# Altium project STM32F417 Demo Board.PrjPcb (part 1 of 4)
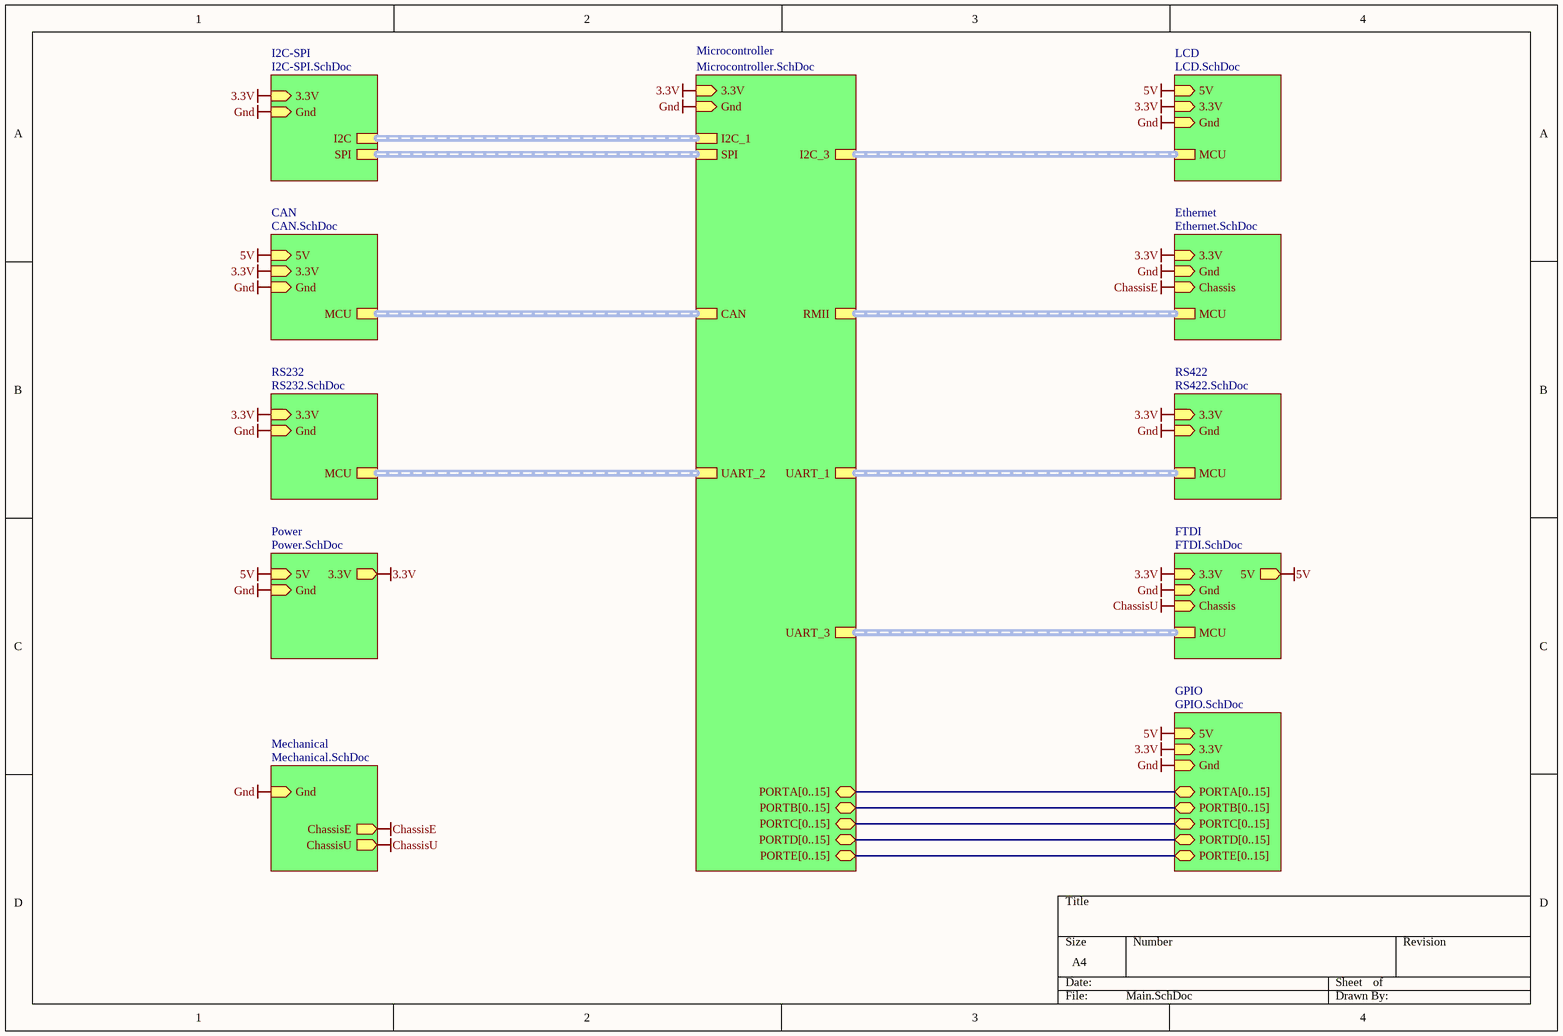
[diagram p0: Main.SchDoc]
15 sheets, 357 parts. Net scope: strictly hierarchical (ports join the sheet entries above them; power ports are local).
Board file: PCB.PcbDoc
Sheets:
  Main.SchDoc
    Microcontroller = Microcontroller.SchDoc
    LCD = LCD.SchDoc
    FTDI = FTDI.SchDoc
    Power = Power.SchDoc
    GPIO = GPIO.SchDoc
      Bt1 = Button.SchDoc
      Bt2 = Button.SchDoc
      Bt3 = Button.SchDoc
      Sw1 = Switch.SchDoc
      Sw2 = Switch.SchDoc
      Sw3 = Switch.SchDoc
      LdR = Led Driver.SchDoc
      LdO = Led Driver.SchDoc
      LdY = Led Driver.SchDoc
      LdG = Led Driver.SchDoc
    Ethernet = Ethernet.SchDoc
    RS422 = RS422.SchDoc
    RS232 = RS232.SchDoc
    CAN = CAN.SchDoc
    Mechanical = Mechanical.SchDoc
    I2C-SPI = I2C-SPI.SchDoc

## Sheet Main.SchDoc
size A4; SheetNumber: 1; SheetTotal: 15

### Sub-sheets
CAN = CAN.SchDoc: 3.3V (in), Gnd (in), MCU (harness CAN), 5V (in)
Ethernet = Ethernet.SchDoc: 3.3V (in), Gnd (in), MCU (harness RMII), Chassis (in)
FTDI = FTDI.SchDoc: 3.3V (in), Gnd (in), MCU (harness UART), 5V (out), Chassis (in)
GPIO = GPIO.SchDoc: 3.3V (in), Gnd (in), PORTA[0..15] (bidir), PORTB[0..15] (bidir), PORTC[0..15] (bidir), PORTD[0..15] (bidir), PORTE[0..15] (bidir), 5V (in)
I2C-SPI = I2C-SPI.SchDoc: 3.3V (in), Gnd (in), I2C (harness I2C), SPI (harness SPI)
LCD = LCD.SchDoc: 3.3V (in), Gnd (in), MCU (harness I2C), 5V (in)
Mechanical = Mechanical.SchDoc: ChassisU (out), Gnd (in), ChassisE (out)
Microcontroller = Microcontroller.SchDoc: I2C_3 (harness I2C), I2C_1 (harness I2C), UART_3 (harness UART), UART_1 (harness UART), UART_2 (harness UART), RMII (harness RMII), CAN (harness CAN), PORTA[0..15] (bidir), PORTB[0..15] (bidir), PORTC[0..15] (bidir), PORTD[0..15] (bidir), PORTE[0..15] (bidir), 3.3V (in), Gnd (in), SPI (harness SPI)
Power = Power.SchDoc: 5V (in), Gnd (in), 3.3V (out)
RS232 = RS232.SchDoc: 3.3V (in), Gnd (in), MCU (harness UART)
RS422 = RS422.SchDoc: 3.3V (in), Gnd (in), MCU (harness UART)

### Nets
3.3V: sheet Microcontroller/3.3V, sheet LCD/3.3V, sheet FTDI/3.3V, sheet Power/3.3V, sheet GPIO/3.3V, sheet Ethernet/3.3V, sheet RS422/3.3V, sheet RS232/3.3V, sheet CAN/3.3V, sheet I2C-SPI/3.3V
5V: sheet LCD/5V, sheet FTDI/5V, sheet Power/5V, sheet GPIO/5V, sheet CAN/5V
ChassisE: sheet Ethernet/Chassis, sheet Mechanical/ChassisE
ChassisU: sheet FTDI/Chassis, sheet Mechanical/ChassisU
Gnd: sheet Microcontroller/Gnd, sheet LCD/Gnd, sheet FTDI/Gnd, sheet Power/Gnd, sheet GPIO/Gnd, sheet Ethernet/Gnd, sheet RS422/Gnd, sheet RS232/Gnd, sheet CAN/Gnd, sheet Mechanical/Gnd, sheet I2C-SPI/Gnd

### Buses and harness runs
bus sheet GPIO/PORTA[0..15] = sheet Microcontroller/PORTA[0..15]
bus sheet GPIO/PORTB[0..15] = sheet Microcontroller/PORTB[0..15]
bus sheet GPIO/PORTC[0..15] = sheet Microcontroller/PORTC[0..15]
bus sheet GPIO/PORTD[0..15] = sheet Microcontroller/PORTD[0..15]
bus sheet GPIO/PORTE[0..15] = sheet Microcontroller/PORTE[0..15]
harness sheet CAN/MCU = sheet Microcontroller/CAN
harness sheet Ethernet/MCU = sheet Microcontroller/RMII
harness sheet FTDI/MCU = sheet Microcontroller/UART_3
harness sheet I2C-SPI/I2C = sheet Microcontroller/I2C_1
harness sheet I2C-SPI/SPI = sheet Microcontroller/SPI
harness sheet LCD/MCU = sheet Microcontroller/I2C_3
harness sheet Microcontroller/UART_1 = sheet RS422/MCU
harness sheet Microcontroller/UART_2 = sheet RS232/MCU

## Sheet Microcontroller.SchDoc
size 400 x 350 mm; SheetNumber: 2; SheetTotal: 15
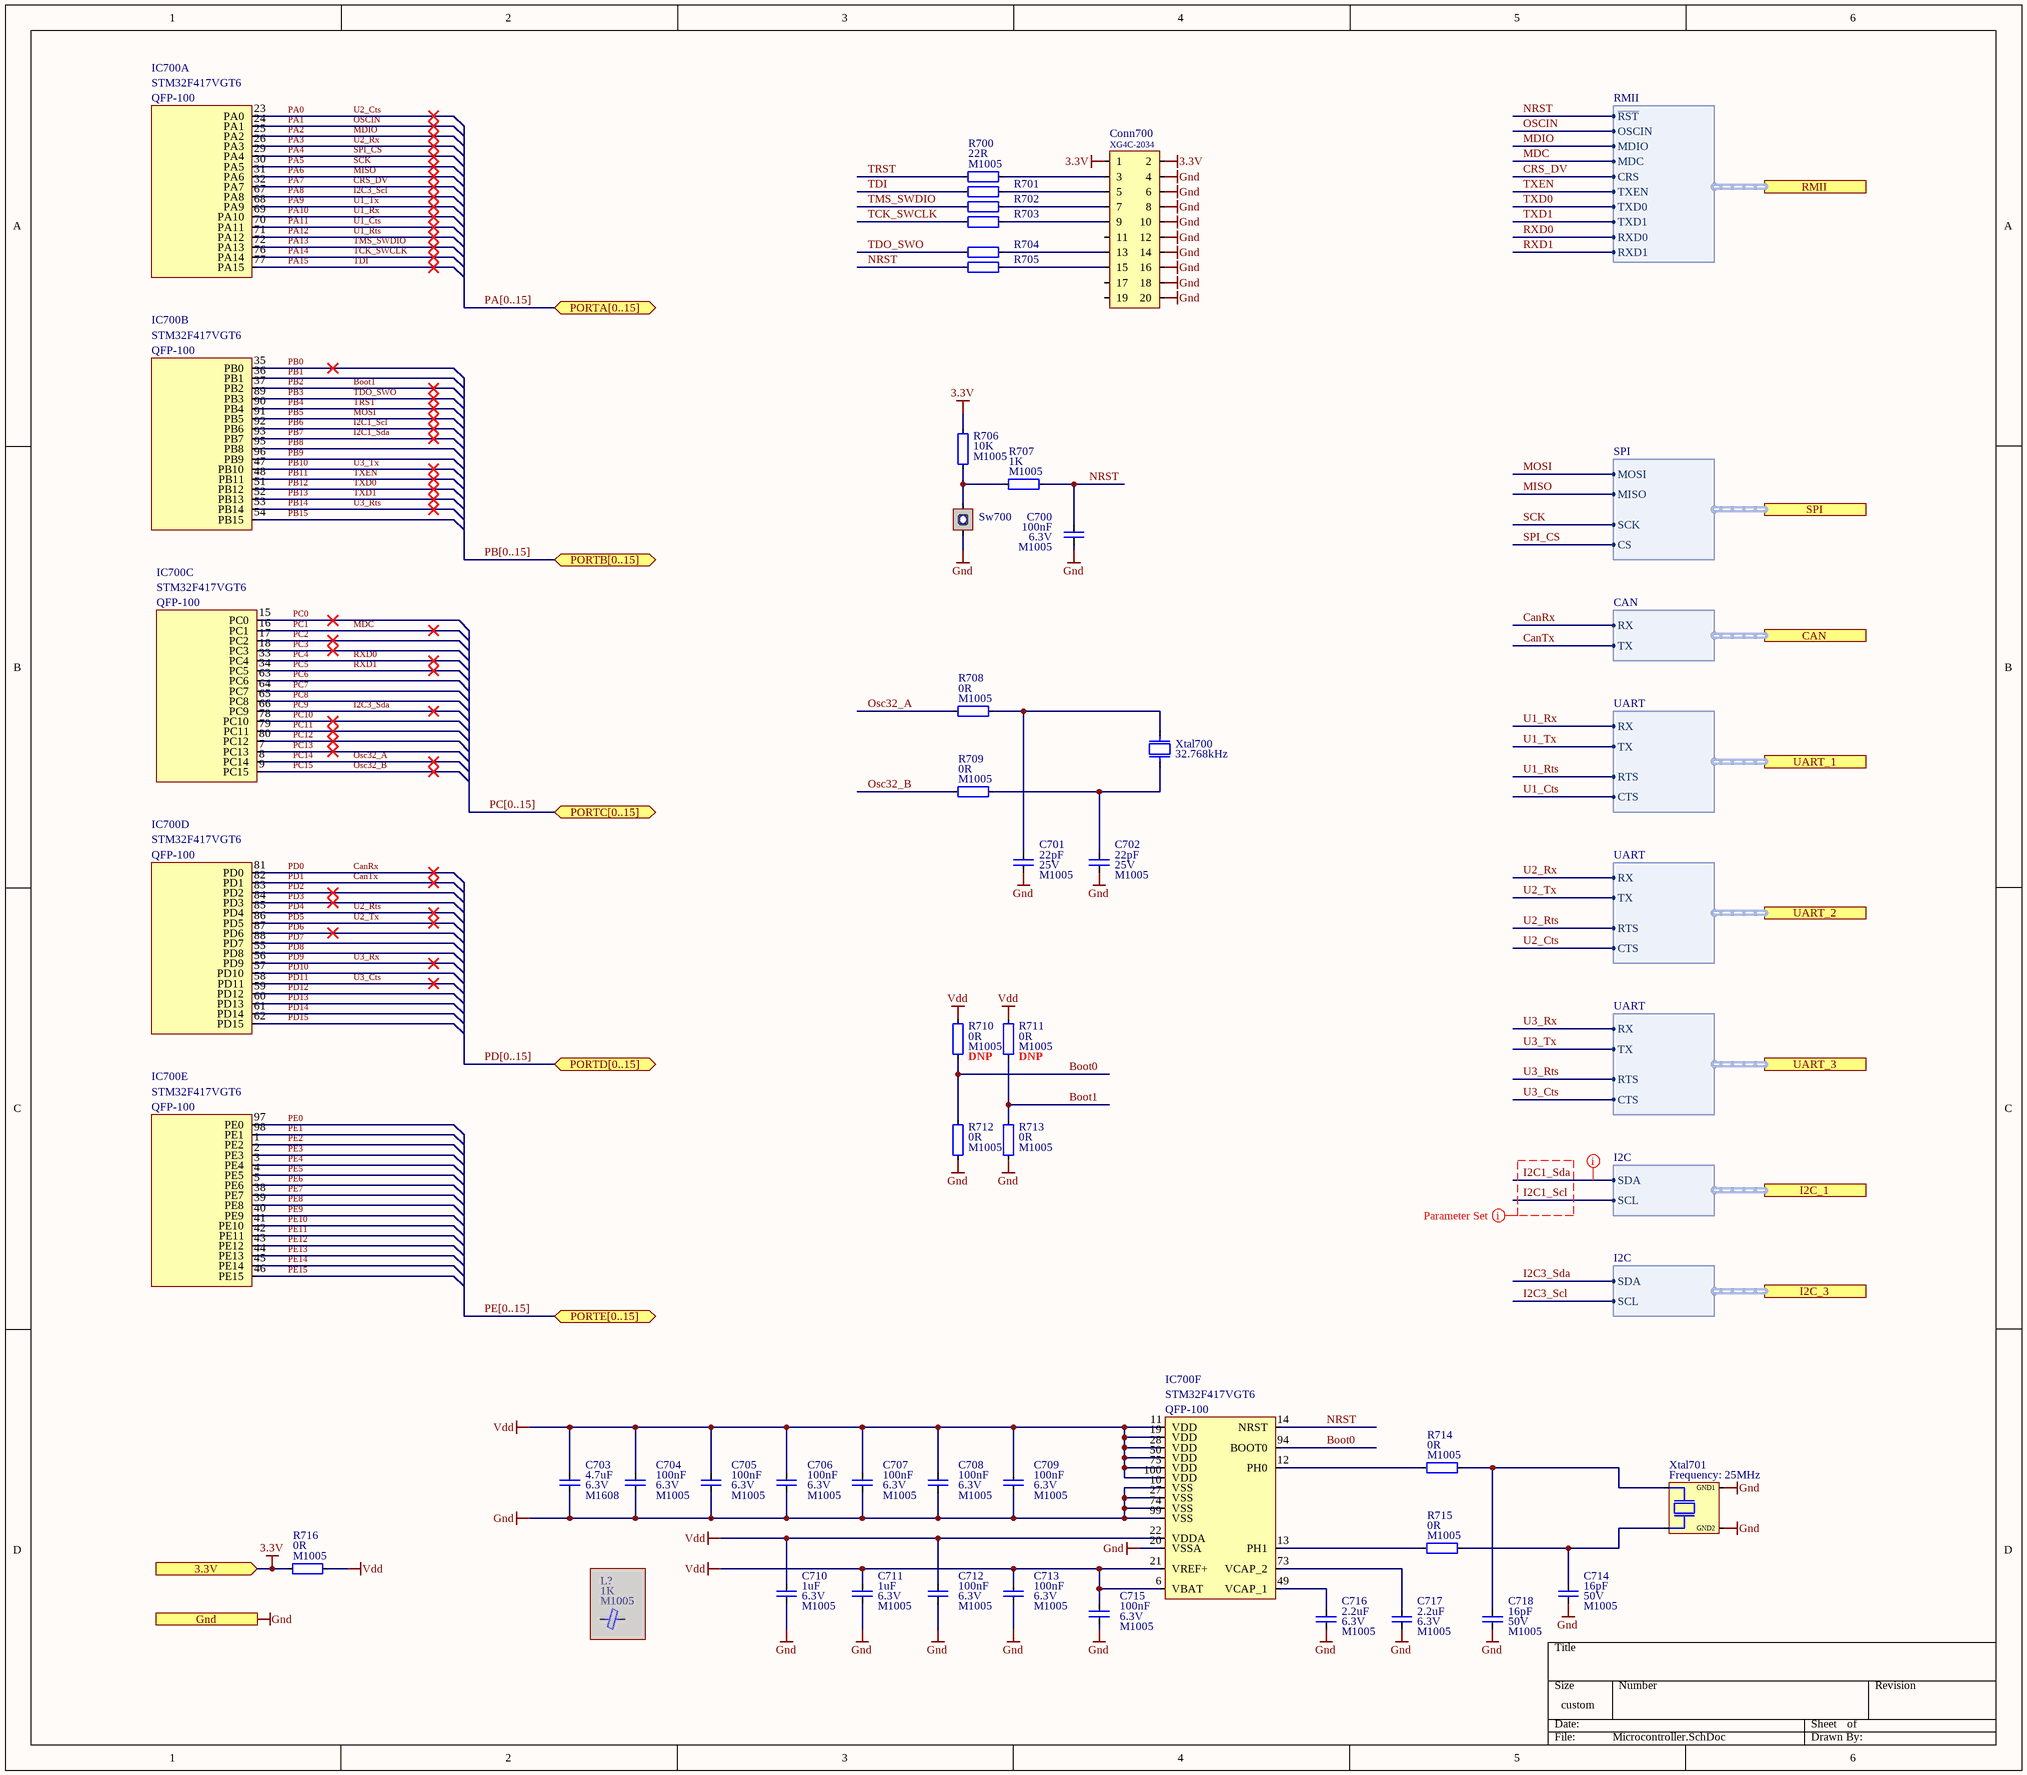
[diagram p1: Microcontroller.SchDoc]

### Parts
C700  value 100nF  Voltage: 6.3V  Package: M1005  [Capacitor_Ceramic_M1005_I0402]  (hidden comment: Capacitor_Ceramic)
C701  value 22pF  Voltage: 25V  Package: M1005  [Capacitor_Ceramic_M1005_I0402]  (hidden comment: Capacitor_Ceramic)
C702  value 22pF  Voltage: 25V  Package: M1005  [Capacitor_Ceramic_M1005_I0402]  (hidden comment: Capacitor_Ceramic)
C703  value 4.7uF  Voltage: 6.3V  Package: M1608  [Capacitor_Ceramic_M1608_I0603]  (hidden comment: Capacitor_Ceramic)
C704  value 100nF  Voltage: 6.3V  Package: M1005  [Capacitor_Ceramic_M1005_I0402]  (hidden comment: Capacitor_Ceramic)
C705  value 100nF  Voltage: 6.3V  Package: M1005  [Capacitor_Ceramic_M1005_I0402]  (hidden comment: Capacitor_Ceramic)
C706  value 100nF  Voltage: 6.3V  Package: M1005  [Capacitor_Ceramic_M1005_I0402]  (hidden comment: Capacitor_Ceramic)
C707  value 100nF  Voltage: 6.3V  Package: M1005  [Capacitor_Ceramic_M1005_I0402]  (hidden comment: Capacitor_Ceramic)
C708  value 100nF  Voltage: 6.3V  Package: M1005  [Capacitor_Ceramic_M1005_I0402]  (hidden comment: Capacitor_Ceramic)
C709  value 100nF  Voltage: 6.3V  Package: M1005  [Capacitor_Ceramic_M1005_I0402]  (hidden comment: Capacitor_Ceramic)
C710  value 1uF  Voltage: 6.3V  Package: M1005  [Capacitor_Ceramic_M1005_I0402]  (hidden comment: Capacitor_Ceramic)
C711  value 1uF  Voltage: 6.3V  Package: M1005  [Capacitor_Ceramic_M1005_I0402]  (hidden comment: Capacitor_Ceramic)
C712  value 100nF  Voltage: 6.3V  Package: M1005  [Capacitor_Ceramic_M1005_I0402]  (hidden comment: Capacitor_Ceramic)
C713  value 100nF  Voltage: 6.3V  Package: M1005  [Capacitor_Ceramic_M1005_I0402]  (hidden comment: Capacitor_Ceramic)
C714  value 16pF  Voltage: 50V  Package: M1005  [Capacitor_Ceramic_M1005_I0402]  (hidden comment: Capacitor_Ceramic)
C715  value 100nF  Voltage: 6.3V  Package: M1005  [Capacitor_Ceramic_M1005_I0402]  (hidden comment: Capacitor_Ceramic)
C716  value 2.2uF  Voltage: 6.3V  Package: M1005  [Capacitor_Ceramic_M1005_I0402]  (hidden comment: Capacitor_Ceramic)
C717  value 2.2uF  Voltage: 6.3V  Package: M1005  [Capacitor_Ceramic_M1005_I0402]  (hidden comment: Capacitor_Ceramic)
C718  value 16pF  Voltage: 50V  Package: M1005  [Capacitor_Ceramic_M1005_I0402]  (hidden comment: Capacitor_Ceramic)
Conn700  Manufacturer Part Number: XG4C-2034  [Connector - Omron, XG4C-2034]  (hidden comment: Connector - 20P)
IC700  Manufacturer Part Number: STM32F417VGT6  Package: QFP-100  [QFP-100, 14mm x 14mm, 0.5mm]  (hidden comment: STM, STM32F417VxTx)  (parts A,B,C,D,E,F of 6)
L?  value 1K  Package: M1005  [Ferrite_Bead_Smd_M1005_I0402]  (hidden comment: Ferrite Bead)  (masked out: inside a compile mask, not in the netlist)
R700  value 22R  Package: M1005  [Resistor_Smd_M1005_I0402]  (hidden comment: Resistor)
R701  Resistor  [Resistor_Smd_M1005_I0402]  (value not drawn)
R702  Resistor  [Resistor_Smd_M1005_I0402]  (value not drawn)
R703  Resistor  [Resistor_Smd_M1005_I0402]  (value not drawn)
R704  Resistor  [Resistor_Smd_M1005_I0402]  (value not drawn)
R705  Resistor  [Resistor_Smd_M1005_I0402]  (value not drawn)
R706  value 10K  Package: M1005  [Resistor_Smd_M1005_I0402]  (hidden comment: Resistor)
R707  value 1K  Package: M1005  [Resistor_Smd_M1005_I0402]  (hidden comment: Resistor)
R708  value 0R  Package: M1005  [Resistor_Smd_M1005_I0402]  (hidden comment: Resistor)
R709  value 0R  Package: M1005  [Resistor_Smd_M1005_I0402]  (hidden comment: Resistor)
R710  value 0R  Package: M1005  [Resistor_Smd_M1005_I0402]  (hidden comment: Resistor)
R711  value 0R  Package: M1005  [Resistor_Smd_M1005_I0402]  (hidden comment: Resistor)
R712  value 0R  Package: M1005  [Resistor_Smd_M1005_I0402]  (hidden comment: Resistor)
R713  value 0R  Package: M1005  [Resistor_Smd_M1005_I0402]  (hidden comment: Resistor)
R714  value 0R  Package: M1005  [Resistor_Smd_M1005_I0402]  (hidden comment: Resistor)
R715  value 0R  Package: M1005  [Resistor_Smd_M1005_I0402]  (hidden comment: Resistor)
R716  value 0R  Package: M1005  [Resistor_Smd_M1005_I0402]  (hidden comment: Resistor)
Sw700  Tactile, SPST  [Tactile, SPST - Panasonic, EVQQ2]  (value not drawn)
Xtal700  Frequency: 32.768kHz  [NDK, NX3215SA]  (hidden comment: Crystal)
Xtal701  Frequency: 25MHz  [Kyocera, CX3225SB]  (hidden comment: Crystal, Two Gnd Pins)

### Ports
3.3V (in), CAN (harness CAN), Gnd (in), I2C_1 (harness I2C), I2C_3 (harness I2C), PORTA[0..15] (bidir), PORTB[0..15] (bidir), PORTC[0..15] (bidir), PORTD[0..15] (bidir), PORTE[0..15] (bidir), RMII (harness RMII), SPI (harness SPI), UART_1 (harness UART), UART_2 (harness UART), UART_3 (harness UART)

### Harnesses
I2C: SDA, SCL
UART: RX, TX, RTS, CTS
CAN: RX, TX
SPI: MOSI, MISO, SCK, CS
RMII: ~{RST}, OSCIN, MDIO, CRS, MDC, TXEN, TXD0, TXD1, RXD0, RXD1

### Nets
3.3V: Conn700.1 Conn700.2 R706.1 R716.1 ; port 3.3V
Gnd: C700.2 C701.2 C702.2 C703.2 C704.2 C705.2 C706.2 C707.2 C708.2 C709.2 C710.2 C711.2 C712.2 C713.2 C714.2 C715.2 C716.2 C717.2 C718.2 Conn700.4 Conn700.6 Conn700.8 Conn700.10 Conn700.12 Conn700.14 Conn700.16 Conn700.18 Conn700.20 IC700.10(VSS) IC700.20(VSSA) IC700.27(VSS) IC700.74(VSS) IC700.99(VSS) R712.1 R713.1 Sw700.B Xtal701.GND1 Xtal701.GND2 ; port Gnd
Vdd: C703.1 C704.1 C705.1 C706.1 C707.1 C708.1 C709.1 C710.1 C711.1 C712.1 C713.1 C715.1 IC700.6(VBAT) IC700.11(VDD) IC700.19(VDD) IC700.21(VREF+) IC700.22(VDDA) IC700.28(VDD) IC700.50(VDD) IC700.75(VDD) IC700.100(VDD) R710.2 R711.2 R716.2
Boot0: IC700.94(BOOT0) R710.1 R712.2
Boot1: IC700.37(PB2) R711.1 R713.2  [also labelled PB2]
CanRx: IC700.81(PD0) ; port CAN.RX  [also labelled PD0]
CanTx: IC700.82(PD1) ; port CAN.TX  [also labelled PD1]
CRS_DV: IC700.32(PA7) ; port RMII.CRS  [also labelled PA7]
I2C1_Scl: IC700.92(PB6) ; port I2C_1.SCL  [also labelled PB6]
I2C1_Sda: IC700.93(PB7) ; port I2C_1.SDA  [also labelled PB7]
I2C3_Scl: IC700.67(PA8) ; port I2C_3.SCL  [also labelled PA8]
I2C3_Sda: IC700.66(PC9) ; port I2C_3.SDA  [also labelled PC9]
MDC: IC700.16(PC1) ; port RMII.MDC  [also labelled PC1]
MDIO: IC700.25(PA2) ; port RMII.MDIO  [also labelled PA2]
MISO: IC700.31(PA6) ; port SPI.MISO  [also labelled PA6]
MOSI: IC700.91(PB5) ; port SPI.MOSI  [also labelled PB5]
NRST: C700.1 IC700.14(NRST) R705.1 R707.2 ; port RMII.~{RST}
Osc32_A: IC700.8(PC14) R708.1  [also labelled PC14]
Osc32_B: IC700.9(PC15) R709.1  [also labelled PC15]
OSCIN: IC700.24(PA1) ; port RMII.OSCIN  [also labelled PA1]
PA0: IC700.23(PA0) ; port UART_2.CTS  [also labelled U2_Cts]
PA3: IC700.26(PA3) ; port UART_2.RX  [also labelled U2_Rx]
PA4: IC700.29(PA4) ; port SPI.CS  [also labelled SPI_CS]
PA5: IC700.30(PA5) ; port SPI.SCK  [also labelled SCK]
PA9: IC700.68(PA9) ; port UART_1.TX  [also labelled U1_Tx]
PA10: IC700.69(PA10) ; port UART_1.RX  [also labelled U1_Rx]
PA11: IC700.70(PA11) ; port UART_1.CTS  [also labelled U1_Cts]
PA12: IC700.71(PA12) ; port UART_1.RTS  [also labelled U1_Rts]
PA13: IC700.72(PA13) R702.1  [also labelled TMS_SWDIO]
PA14: IC700.76(PA14) R703.1  [also labelled TCK_SWCLK]
PA15: IC700.77(PA15) R701.1  [also labelled TDI]
PB0: IC700.35(PB0)
PB1: IC700.36(PB1)
PB3: IC700.89(PB3) R704.1  [also labelled TDO_SWO]
PB4: IC700.90(PB4) R700.1  [also labelled TRST]
PB8: IC700.95(PB8)
PB9: IC700.96(PB9)
PB10: IC700.47(PB10) ; port UART_3.TX  [also labelled U3_Tx]
PB11: IC700.48(PB11) ; port RMII.TXEN  [also labelled TXEN]
PB12: IC700.51(PB12) ; port RMII.TXD0  [also labelled TXD0]
PB13: IC700.52(PB13) ; port RMII.TXD1  [also labelled TXD1]
PB14: IC700.53(PB14) ; port UART_3.RTS  [also labelled U3_Rts]
PB15: IC700.54(PB15)
PC0: IC700.15(PC0)
PC2: IC700.17(PC2)
PC3: IC700.18(PC3)
PC4: IC700.33(PC4) ; port RMII.RXD0  [also labelled RXD0]
PC5: IC700.34(PC5) ; port RMII.RXD1  [also labelled RXD1]
PC6: IC700.63(PC6)
PC7: IC700.64(PC7)
PC8: IC700.65(PC8)
PC10: IC700.78(PC10)
PC11: IC700.79(PC11)
PC12: IC700.80(PC12)
PC13: IC700.7(PC13)
PD2: IC700.83(PD2)
PD3: IC700.84(PD3)
PD4: IC700.85(PD4) ; port UART_2.RTS  [also labelled U2_Rts]
PD5: IC700.86(PD5) ; port UART_2.TX  [also labelled U2_Tx]
PD6: IC700.87(PD6)
PD7: IC700.88(PD7)
PD8: IC700.55(PD8)
PD9: IC700.56(PD9) ; port UART_3.RX  [also labelled U3_Rx]
PD10: IC700.57(PD10)
PD11: IC700.58(PD11) ; port UART_3.CTS  [also labelled U3_Cts]
PD12: IC700.59(PD12)
PD13: IC700.60(PD13)
PD14: IC700.61(PD14)
PD15: IC700.62(PD15)
PE0: IC700.97(PE0)
PE1: IC700.98(PE1)
PE2: IC700.1(PE2)
PE3: IC700.2(PE3)
PE4: IC700.3(PE4)
PE5: IC700.4(PE5)
PE6: IC700.5(PE6)
PE7: IC700.38(PE7)
PE8: IC700.39(PE8)
PE9: IC700.40(PE9)
PE10: IC700.41(PE10)
PE11: IC700.42(PE11)
PE12: IC700.43(PE12)
PE13: IC700.44(PE13)
PE14: IC700.45(PE14)
PE15: IC700.46(PE15)
NetC701_1: C701.1 R708.2 Xtal700.2
NetC702_1: C702.1 R709.2 Xtal700.1
NetC714_1: C714.1 R715.2 Xtal701.1
NetC716_1: C716.1 IC700.49(VCAP_1)
NetC717_1: C717.1 IC700.73(VCAP_2)
NetC718_1: C718.1 R714.2 Xtal701.2
NetConn700_3: Conn700.3 R700.2
NetConn700_5: Conn700.5 R701.2
NetConn700_7: Conn700.7 R702.2
NetConn700_9: Conn700.9 R703.2
NetConn700_13: Conn700.13 R704.2
NetConn700_15: Conn700.15 R705.2
NetIC700_12: IC700.12(PH0) R714.1
NetIC700_13: IC700.13(PH1) R715.1
NetR706_2: R706.2 R707.1 Sw700.A

Not connected (* = marked no-connect by the designer): Conn700 11 17 19

### Buses and harness runs
bus PA[0..15] = port PORTA[0..15]
bus PB[0..15] = port PORTB[0..15]
bus PC[0..15] = port PORTC[0..15]
bus PD[0..15] = port PORTD[0..15]
bus PE[0..15] = port PORTE[0..15]

### Layout directives
net class I2C_LM: I2C1_Scl, I2C1_Sda

### Notes on the sheet
- (near R710) DNP
- (near R711) DNP

### Library data of the parts
C700 C704-C709 C712 C713 C715 = Capacitor_Ceramic: Cap, Cer, 100nF, 6.3V, M1005; Manufacturer Part Number: 04026D104KAT4A; Manufacturer: Kyocera; Temperature Coefficient: X5R; Tolerance: 10%; ComponentLink1Description: Datasheet; ComponentLink1URL: E:\Altium\Datasheets\Capacitor\Kyocera - X5R.pdf; ComponentLink2Description: Supplier Link; ComponentLink2URL: https://www.digikey.com/en/products/detail/kyocera-avx/04026D104KAT4A/8107673; Supplier: Digikey; Supplier Part Number: 478-11504-1-ND; Operating Temperature, Min: +85℃; Operating Temperature, Max: -55℃; Quantity, Min: 1; Quantity, Max: 250000; Price, Min: 0.1; Supplier Currency: $; Price, Max: 0.00189; Supplier Link: https://www.digikey.com/en/products/detail/kyocera-avx/04026D104KAT4A/8107673; Component Type: Ceramic; Component Category: Capacitor
C701 C702 = Capacitor_Ceramic: Cap, Cer, 22pF, 25V, M1005; Manufacturer Part Number: 0402N220J250CT; Manufacturer: Walsin; Temperature Coefficient: C0G, NP0; Tolerance: 5%; ComponentLink1Description: Datasheet; ComponentLink1URL: E:\Altium\Datasheets\Capacitor\Walsin - Multilayer Ceramic Capacitors.pdf; ComponentLink2Description: Supplier Link; ComponentLink2URL: https://www.digikey.com/en/products/detail/walsin-technology-corporation/0402N220J250CT/9354779; Supplier: Digikey; Supplier Part Number: 1292-1282-1-ND; Operating Temperature, Min: +125℃; Operating Temperature, Max: -55℃; Quantity, Min: 1; Quantity, Max: 250000; Price, Min: 0.1; Supplier Currency: $; Price, Max: 0.00177; Supplier Link: https://www.digikey.com/en/products/detail/walsin-technology-corporation/0402N220J250CT/9354779; Component Type: Ceramic; Component Category: Capacitor
C703 = Capacitor_Ceramic: Cap, Cer, 4.7uF, 6.3V, M1608; Manufacturer Part Number: CL10A475KQ8NNNC; Manufacturer: Samsung; Temperature Coefficient: X5R; Tolerance: 10%; ComponentLink1Description: Datasheet; ComponentLink1URL: E:\Altium\Datasheets\Capacitor\Samsung - Multi Layer Ceramic Capacitors.pdf; ComponentLink2Description: Supplier Link; ComponentLink2URL: https://www.digikey.com/en/products/detail/samsung-electro-mechanics/CL10A475KQ8NNNC/3886703; Supplier: Digikey; Supplier Part Number: 1276-1045-1-ND; Operating Temperature, Min: +85℃; Operating Temperature, Max: -55℃; Quantity, Min: 1; Quantity, Max: 400000; Price, Min: 0.1; Supplier Currency: $; Price, Max: 0.00444; Supplier Link: https://www.digikey.com/en/products/detail/samsung-electro-mechanics/CL10A475KQ8NNNC/3886703; Component Type: Ceramic; Component Category: Capacitor
C710 C711 = Capacitor_Ceramic: Cap, Cer, 1uF, 6.3V, M1005; Manufacturer Part Number: CL05A105MQ5NNNC; Manufacturer: Samsung; Temperature Coefficient: X5R; Tolerance: 20%; ComponentLink1Description: Datasheet; ComponentLink1URL: E:\Altium\Datasheets\Capacitor\Samsung - Multi Layer Ceramic Capacitors.pdf; ComponentLink2Description: Supplier Link; ComponentLink2URL: https://www.digikey.com/en/products/detail/samsung-electro-mechanics/CL05A105MQ5NNNC/3886893; Supplier: Digikey; Supplier Part Number: 1276-1235-1-ND; Operating Temperature, Min: +85℃; Operating Temperature, Max: -55℃; Quantity, Min: 1; Quantity, Max: 250000; Price, Min: 0.1; Supplier Currency: $; Price, Max: 0.00144; Supplier Link: https://www.digikey.com/en/products/detail/samsung-electro-mechanics/CL05A105MQ5NNNC/3886893; Component Type: Ceramic; Component Category: Capacitor
C714 C718 = Capacitor_Ceramic: Cap, Cer, 16pF, 50V, M1005; Manufacturer Part Number: 0402N160J500CT; Manufacturer: Walsin; Temperature Coefficient: C0G, NP0; Tolerance: 5%; ComponentLink1Description: Datasheet; ComponentLink1URL: E:\Altium\Datasheets\Capacitor\Walsin - Multilayer Ceramic Capacitors.pdf; ComponentLink2Description: Supplier Link; ComponentLink2URL: https://www.digikey.com/en/products/detail/walsin-technology-corporation/0402N160J500CT/9354759; Supplier: Digikey; Supplier Part Number: 1292-1262-1-ND; Operating Temperature, Min: +125℃; Operating Temperature, Max: -55℃; Quantity, Min: 1; Quantity, Max: 250000; Price, Min: 0.1; Supplier Currency: $; Price, Max: 0.00417; Supplier Link: https://www.digikey.com/en/products/detail/walsin-technology-corporation/0402N160J500CT/9354759; Component Type: Ceramic; Component Category: Capacitor
C716 C717 = Capacitor_Ceramic: Cap, Cer, 2.2uF, 6.3V, M1005; Manufacturer Part Number: CL05A225MQ5NNNC; Manufacturer: Samsung; Temperature Coefficient: X5R; Tolerance: 20%; ComponentLink1Description: Datasheet; ComponentLink1URL: E:\Altium\Datasheets\Capacitor\Samsung - Multi Layer Ceramic Capacitors.pdf; ComponentLink2Description: Supplier Link; ComponentLink2URL: https://www.digikey.com/en/products/detail/samsung-electro-mechanics/CL05A225MQ5NNNC/3887127; Supplier: Digikey; Supplier Part Number: 1276-1469-1-ND; Operating Temperature, Min: +85℃; Operating Temperature, Max: -55℃; Quantity, Min: 1; Quantity, Max: 250000; Price, Min: 0.1; Supplier Currency: $; Price, Max: 0.00244; Supplier Link: https://www.digikey.com/en/products/detail/samsung-electro-mechanics/CL05A225MQ5NNNC/3887127; Component Type: Ceramic; Component Category: Capacitor
Conn700 = Connector - 20P: Conn, Header, 20P, RA, TH, Shrouded; Manufacturer: Omron; ComponentLink1Description: Datasheet; ComponentLink1URL: E:\Altium\Datasheets\Connector - Header\Connector - Omron, XG4 Series.pdf; ComponentLink2Description: Supplier Link; ComponentLink2URL: https://www.digikey.com/en/products/detail/omron-electronics-inc-emc-div/XG4C-2034/1787182; Supplier: Digikey; Supplier Part Number: OR900-ND; Operating Temperature, Min: -55℃; Operating Temperature, Max: +105℃; Quantity, Min: 1; Quantity, Max: 450; Price, Min: 1.97; Supplier Currency: $; Price, Max: 1.27716; Supplier Link: https://www.digikey.com/en/products/detail/omron-electronics-inc-emc-div/XG4C-2034/1787182; Component Type: Header; Component Category: Connector; Package: TH, RA, Shrouded
IC700 = STM, STM32F417VxTx: IC, MCU, STM32F417, QFP-100; ComponentLink1Description: Datasheet; ComponentLink1URL: E:\Altium\Datasheets\IC - MCU\STM, STM32F415xx, STM32F417xx.pdf; ComponentLink2Description: Supplier Link; ComponentLink2URL: https://www.digikey.com/en/products/detail/stmicroelectronics/STM32F417VGT6/2757684; Supplier: Digikey; Supplier Part Number: 497-11900-ND; Manufacturer: STM; Operating Temperature, Min: -40℃; Operating Temperature, Max: +85℃; Quantity, Min: 1; Quantity, Max: 450; Price, Min: 19.05; Supplier Currency: $; Price, Max: 13.22667; Supplier Link: https://www.digikey.com/en/products/detail/stmicroelectronics/STM32F417VGT6/2757684; Component Type: MCU; Component Category: IC; ComponentLink3Description: Programming Manual; ComponentLink3URL: E:\Altium\Datasheets\IC - MCU\STM, STM32 Cortex -M4 MCUs and MPUs programming manual.pdf
L? = Ferrite Bead: Manufacturer Part Number: WLBD1005K2U102TP; Manufacturer: Walsin; Component Category: Inductor; ComponentLink1Description: Datasheet; ComponentLink1URL: E:\Altium\Datasheets\Inductor\Walsin, WLBD1005-WLBD4532 Chip Bead Series.pdf; ComponentLink2Description: Supplier Link; ComponentLink2URL: https://www.digikey.com/en/products/detail/walsin-technology-corporation/WLBD1005K2U102TP/14563847; Supplier: Digikey; Supplier Part Number: 1292-WLBD1005K2U102TPCT-ND; Operating Temperature, Min: -55℃; Operating Temperature, Max: +125℃; Quantity, Min: 1; Quantity, Max: 50000; Price, Min: 0.1; Price, Max: 0.0021; Supplier Currency: $; Supplier Link: https://www.digikey.com/en/products/detail/walsin-technology-corporation/WLBD1005K2U102TP/14563847; Component Type: Ferrite Bead
R700-R705 = Resistor: Res, 22R, 1%, M1005; Manufacturer: Yageo; Manufacturer Part Number: RC0402FR-0722RL; Component Category: Resistor; Component Type: Fixed Value; Tolerance: 1%; Supplier Link: https://www.digikey.com/en/products/detail/yageo/RC0402FR-0722RL/726562; Supplier Currency: $; Price, Max: 0.00129; Price, Min: 0.1; Quantity, Max: 100000; Quantity, Min: 1; Operating Temperature, Max: -55℃; Operating Temperature, Min: +155℃; Supplier Part Number: 311-22.0LRCT-ND; Supplier: Digikey; ComponentLink1Description: Datasheet; ComponentLink1URL: E:\Altium\Datasheets\Resistor\Yageo - RC_L Series.pdf; ComponentLink2Description: Supplier Link; ComponentLink2URL: https://www.digikey.com/en/products/detail/yageo/RC0402FR-0722RL/726562
  R701-R705: Value: 22R; Package: M1005
R706 = Resistor: Res, 10K, 1%, M1005; Manufacturer: Yageo; Manufacturer Part Number: RC0402FR-0710KP; Component Category: Resistor; Component Type: Fixed Value; Tolerance: 1%; Supplier Link: https://www.digikey.com/en/products/detail/yageo/RC0402FR-0710KP/4935264; Supplier Currency: $; Price, Max: 0.00282; Price, Min: 0.1; Quantity, Max: 100000; Quantity, Min: 1; Operating Temperature, Max: -55℃; Operating Temperature, Min: +155℃; Supplier Part Number: YAG1249CT-ND; Supplier: Digikey; ComponentLink1Description: Datasheet; ComponentLink1URL: E:\Altium\Datasheets\Resistor\Yageo - RC_L Series.pdf; ComponentLink2Description: Supplier Link; ComponentLink2URL: https://www.digikey.com/en/products/detail/yageo/RC0402FR-0710KP/4935264
R707 = Resistor: Res, 1K, 1%, M1005; Manufacturer: Yageo; Manufacturer Part Number: RC0402FR-071KP; Component Category: Resistor; Component Type: Fixed Value; Tolerance: 1%; Supplier Link: https://www.digikey.com/en/products/detail/yageo/RC0402FR-071KP/4935269; Supplier Currency: $; Price, Max: 0.00282; Price, Min: 0.1; Quantity, Max: 100000; Quantity, Min: 1; Operating Temperature, Max: -55℃; Operating Temperature, Min: +155℃; Supplier Part Number: YAG1254CT-ND; Supplier: Digikey; ComponentLink1Description: Datasheet; ComponentLink1URL: E:\Altium\Datasheets\Resistor\Yageo - RC_L Series.pdf; ComponentLink2Description: Supplier Link; ComponentLink2URL: https://www.digikey.com/en/products/detail/yageo/RC0402FR-071KP/4935269
R708-R716 = Resistor: Res, 0R, M1005; Manufacturer: Yageo; Manufacturer Part Number: RC0402FR-070RL; Component Category: Resistor; Component Type: Fixed Value; Tolerance: *; Supplier Link: https://www.digikey.com/en/products/detail/yageo/RC0402FR-070RL/2827570; Supplier Currency: $; Price, Max: 0.00109; Price, Min: 0.1; Quantity, Max: 50000; Quantity, Min: 1; Operating Temperature, Max: -55℃; Operating Temperature, Min: +155℃; Supplier Part Number: 311-0.0LRCT-ND; Supplier: Digikey; ComponentLink1Description: Datasheet; ComponentLink1URL: E:\Altium\Datasheets\Resistor\Yageo - RC_L Series.pdf; ComponentLink2Description: Supplier Link; ComponentLink2URL: https://www.digikey.com/en/products/detail/yageo/RC0402FR-070RL/2827570
Sw700 = Tactile, SPST: Switch, Tactile, SPST, SMD; Manufacturer: Panasonic; Manufacturer Part Number: EVQ-Q2K03W; ComponentLink1Description: Datasheet; ComponentLink1URL: E:\Altium\Datasheets\Switch\Tactile, SPST - Panasonic, EVQP0, EVQQ2, EVQ6Q2, EVQ7Q2, EVPBT Series.pdf; ComponentLink2Description: Supplier Link; ComponentLink2URL: https://www.digikey.com/en/products/detail/panasonic-electronic-components/EVQ-Q2K03W/762893; Supplier: Digikey; Supplier Part Number: P12943SCT-ND; Operating Temperature, Min: -40℃; Operating Temperature, Max: +85℃; Quantity, Min: 1; Quantity, Max: 10000; Price, Min: 0.32; Supplier Currency: $; Price, Max: 0.16174; Supplier Link: https://www.digikey.com/en/products/detail/panasonic-electronic-components/EVQ-Q2K03W/762893; Component Type: Tactile; Component Category: Switch; Package: SMD
Xtal700 = Crystal: XTAL, 32.768kHz, 12.5pF; Manufacturer: NDK; Manufacturer Part Number: NX3215SA-32.768K-STD-MUS-2; ComponentLink1Description: Datasheet; ComponentLink1URL: E:\Altium\Datasheets\Crystal\NDK, NX3215SA.pdf; ComponentLink2Description: Supplier Link; ComponentLink2URL: https://www.digikey.com/en/products/detail/ndk-america-inc/NX3215SA-32-768K-STD-MUS-2/2349033; Supplier: Digikey; Supplier Part Number: 644-1159-1-ND; Operating Temperature, Min: -40℃; Operating Temperature, Max: +125℃; Quantity, Min: 1; Quantity, Max: 15000; Price, Min: 0.74; Supplier Currency: $; Price, Max: 0.3432; Supplier Link: https://www.digikey.com/en/products/detail/ndk-america-inc/NX3215SA-32-768K-STD-MUS-2/2349033; Component Type: Crystal; Component Category: Crystal; Package: SMD
Xtal701 = Crystal, Two Gnd Pins: XTAL, 25MHz, 12pF; Manufacturer: Kyocera; Manufacturer Part Number: CX3225SB25000H0FLJCC; ComponentLink1Description: Datasheet; ComponentLink1URL: E:\Altium\Datasheets\Crystal\Kyocera, CX3225SB.pdf; ComponentLink2Description: Supplier Link; ComponentLink2URL: https://www.digikey.com/en/products/detail/kyocera-avx/cx3225sb25000h0fljcc/6123312; Supplier: Digikey; Supplier Part Number: 478-CX3225SB25000H0FLJCCCT-ND; Operating Temperature, Min: -30℃; Operating Temperature, Max: +85℃; Quantity, Min: 1; Quantity, Max: 15000; Price, Min: 0.66; Supplier Currency: $; Price, Max: 0.34087; Supplier Link: https://www.digikey.com/en/products/detail/kyocera-avx/cx3225sb25000h0fljcc/6123312; Component Type: Crystal; Component Category: Crystal; Package: SMD

## Sheet LCD.SchDoc
size A4; SheetNumber: 5; SheetTotal: 15
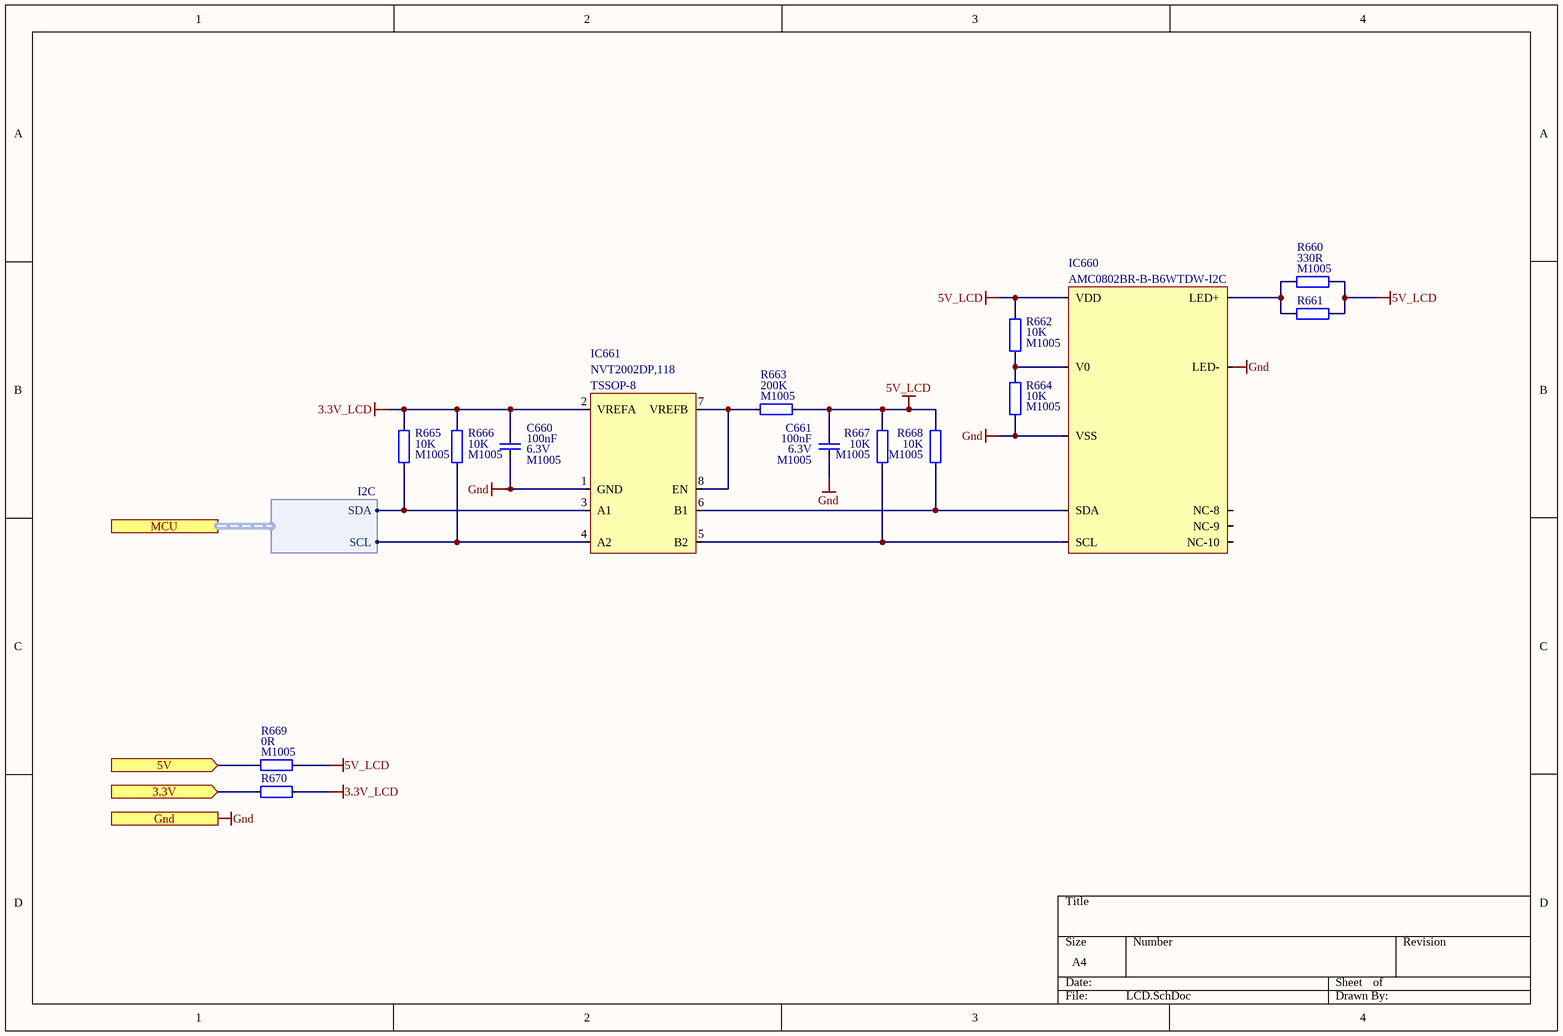
[diagram p2: LCD.SchDoc]

### Parts
C660  value 100nF  Voltage: 6.3V  Package: M1005  [Capacitor_Ceramic_M1005_I0402]  (hidden comment: Capacitor_Ceramic)
C661  value 100nF  Voltage: 6.3V  Package: M1005  [Capacitor_Ceramic_M1005_I0402]  (hidden comment: Capacitor_Ceramic)
IC660  Manufacturer Part Number: AMC0802BR-B-B6WTDW-I2C  [Orient, AMC0802BR-B-B6WTDW-I2C]  (hidden comment: Orient, AMC0802BR-B-B6WTDW-I2C)
IC661  Manufacturer Part Number: NVT2002DP,118  Package: TSSOP-8  [TSSOP-8, Body 3mm, Pitch 0.65mm]  (hidden comment: Voltage Translator, I2C - Nxp, NVT2002DP)
R660  value 330R  Package: M1005  [Resistor_Smd_M1005_I0402]  (hidden comment: Resistor)
R661  Resistor  [Resistor_Smd_M1005_I0402]  (value not drawn)
R662  value 10K  Package: M1005  [Resistor_Smd_M1005_I0402]  (hidden comment: Resistor)
R663  value 200K  Package: M1005  [Resistor_Smd_M1005_I0402]  (hidden comment: Resistor)
R664  value 10K  Package: M1005  [Resistor_Smd_M1005_I0402]  (hidden comment: Resistor)
R665  value 10K  Package: M1005  [Resistor_Smd_M1005_I0402]  (hidden comment: Resistor)
R666  value 10K  Package: M1005  [Resistor_Smd_M1005_I0402]  (hidden comment: Resistor)
R667  value 10K  Package: M1005  [Resistor_Smd_M1005_I0402]  (hidden comment: Resistor)
R668  value 10K  Package: M1005  [Resistor_Smd_M1005_I0402]  (hidden comment: Resistor)
R669  value 0R  Package: M1005  [Resistor_Smd_M1005_I0402]  (hidden comment: Resistor)
R670  Resistor  [Resistor_Smd_M1005_I0402]  (value not drawn)

### Ports
3.3V (in), 5V (in), Gnd (in), MCU (harness I2C)

### Harnesses
I2C: SDA, SCL

### Nets
3.3V: R670.1 ; port 3.3V
3.3V_LCD: C660.1 IC661.2(VREFA) R665.1 R666.1 R670.2
5V: R669.1 ; port 5V
5V_LCD: C661.1 IC660.VDD R660.2 R661.2 R662.1 R663.2 R667.1 R668.1 R669.2
Gnd: C660.2 C661.2 IC660.LED- IC660.VSS IC661.1(GND) R664.2 ; port Gnd
I2C3_Scl: IC661.4(A2) R666.2 ; port MCU.SCL
I2C3_Sda: IC661.3(A1) R665.2 ; port MCU.SDA
NetIC660_LED+: IC660.LED+ R660.1 R661.1
NetIC660_SCL: IC660.SCL IC661.5(B2) R667.2
NetIC660_SDA: IC660.SDA IC661.6(B1) R668.2
NetIC660_V0: IC660.V0 R662.2 R664.1
NetIC661_7: IC661.7(VREFB) IC661.8(EN) R663.1

Not connected (* = marked no-connect by the designer): IC660 NC-8 NC-9 NC-10

### Library data of the parts
C660 C661 = Capacitor_Ceramic: as C700 on sheet Microcontroller; ComponentLink1Description: Datasheet; ComponentLink1URL: E:\Altium\Datasheets\Capacitor\Kyocera - X5R.pdf; ComponentLink2Description: Supplier Link; ComponentLink2URL: https://www.digikey.com/en/products/detail/kyocera-avx/04026D104KAT4A/8107673; Supplier: Digikey; Supplier Part Number: 478-11504-1-ND; Operating Temperature, Min: +85℃; Operating Temperature, Max: -55℃; Quantity, Min: 1; Quantity, Max: 250000; Price, Min: 0.1; Supplier Currency: $; Price, Max: 0.00189; Supplier Link: https://www.digikey.com/en/products/detail/kyocera-avx/04026D104KAT4A/8107673; Component Type: Ceramic; Component Category: Capacitor
IC660 = Orient, AMC0802BR-B-B6WTDW-I2C: Module, Display, Lcd, 2 Lines, I2C; Manufacturer: Orient Display; ComponentLink1Description: Datasheet; ComponentLink1URL: E:\Altium\Datasheets\Module - LCD\Orient, AMC0802BR-B-B6WTDW-I2C.pdf; ComponentLink2Description: Supplier Link; ComponentLink2URL: https://www.digikey.com/en/products/detail/orient-display/AMC0802BR-B-B6WTDW-I2C/12089222; Supplier: Digikey; Supplier Part Number: 3444-AMC0802BR-B-B6WTDW-I2C-ND; Operating Temperature, Min: -20℃; Operating Temperature, Max: +70℃; Quantity, Min: 1; Quantity, Max: 2000; Price, Min: 8.69; Supplier Currency: $; Price, Max: 4.21208; Supplier Link: https://www.digikey.com/en/products/detail/orient-display/AMC0802BR-B-B6WTDW-I2C/12089222; Component Type: LCD; Component Category: Module; Package: Custom
IC661 = Voltage Translator, I2C - Nxp, NVT2002DP: IC, Interface, I2C, TSSOP-8; ComponentLink1Description: Datasheet; ComponentLink1URL: E:\Altium\Datasheets\IC - Interface\Voltage Translator, I2C - Nxp, NVT2001, NVT2002.pdf; ComponentLink2Description: Supplier Link; ComponentLink2URL: https://www.digikey.com/en/products/detail/nxp-usa-inc/NVT2002DP-118/2355938; Supplier: Digikey; Supplier Part Number: 568-5121-1-ND; Manufacturer: Nxp; Operating Temperature, Min: -40℃; Operating Temperature, Max: +85℃; Quantity, Min: 1; Quantity, Max: 5000; Price, Min: 0.94; Supplier Currency: $; Price, Max: 0.35985; Supplier Link: https://www.digikey.com/en/products/detail/nxp-usa-inc/NVT2002DP-118/2355938; Component Type: Interface; Component Category: IC
R660 R661 = Resistor: Res, 330R, 1%, M1005; Manufacturer: Yageo; Manufacturer Part Number: RC0402FR-07330RL; Component Category: Resistor; Component Type: Fixed Value; Tolerance: 1%; Supplier Link: https://www.digikey.com/en/products/detail/yageo/RC0402FR-07330RL/726594; Supplier Currency: $; Price, Max: 0.00129; Price, Min: 0.1; Quantity, Max: 100000; Quantity, Min: 1; Operating Temperature, Max: -55℃; Operating Temperature, Min: +155℃; Supplier Part Number: 311-330LRCT-ND; Supplier: Digikey; ComponentLink1Description: Datasheet; ComponentLink1URL: E:\Altium\Datasheets\Resistor\Yageo - RC_L Series.pdf; ComponentLink2Description: Supplier Link; ComponentLink2URL: https://www.digikey.com/en/products/detail/yageo/RC0402FR-07330RL/726594
  R661: Value: 330R; Package: M1005
R662 R664-R668 = Resistor: as R706 on sheet Microcontroller; Component Category: Resistor; Component Type: Fixed Value; Tolerance: 1%; Supplier Link: https://www.digikey.com/en/products/detail/yageo/RC0402FR-0710KP/4935264; Supplier Currency: $; Price, Max: 0.00282; Price, Min: 0.1; Quantity, Max: 100000; Quantity, Min: 1; Operating Temperature, Max: -55℃; Operating Temperature, Min: +155℃; Supplier Part Number: YAG1249CT-ND; Supplier: Digikey; ComponentLink1Description: Datasheet; ComponentLink1URL: E:\Altium\Datasheets\Resistor\Yageo - RC_L Series.pdf; ComponentLink2Description: Supplier Link; ComponentLink2URL: https://www.digikey.com/en/products/detail/yageo/RC0402FR-0710KP/4935264
R663 = Resistor: Res, 200K, 1%, M1005; Manufacturer: Yageo; Manufacturer Part Number: RC0402FR-07200KL; Component Category: Resistor; Component Type: Fixed Value; Tolerance: 1%; Supplier Link: https://www.digikey.com/en/products/detail/yageo/RC0402FR-07200KL/726558; Supplier Currency: $; Price, Max: 0.00129; Price, Min: 0.1; Quantity, Max: 100000; Quantity, Min: 1; Operating Temperature, Max: -55℃; Operating Temperature, Min: +155℃; Supplier Part Number: 311-200KLRCT-ND; Supplier: Digikey; ComponentLink1Description: Datasheet; ComponentLink1URL: E:\Altium\Datasheets\Resistor\Yageo - RC_L Series.pdf; ComponentLink2Description: Supplier Link; ComponentLink2URL: https://www.digikey.com/en/products/detail/yageo/RC0402FR-07200KL/726558
R669 R670 = Resistor: as R708 on sheet Microcontroller; Component Category: Resistor; Component Type: Fixed Value; Tolerance: *; Supplier Link: https://www.digikey.com/en/products/detail/yageo/RC0402FR-070RL/2827570; Supplier Currency: $; Price, Max: 0.00109; Price, Min: 0.1; Quantity, Max: 50000; Quantity, Min: 1; Operating Temperature, Max: -55℃; Operating Temperature, Min: +155℃; Supplier Part Number: 311-0.0LRCT-ND; Supplier: Digikey; ComponentLink1Description: Datasheet; ComponentLink1URL: E:\Altium\Datasheets\Resistor\Yageo - RC_L Series.pdf; ComponentLink2Description: Supplier Link; ComponentLink2URL: https://www.digikey.com/en/products/detail/yageo/RC0402FR-070RL/2827570
  R670: Value: 0R; Package: M1005

## Sheet FTDI.SchDoc
size A3; SheetNumber: 8; SheetTotal: 15
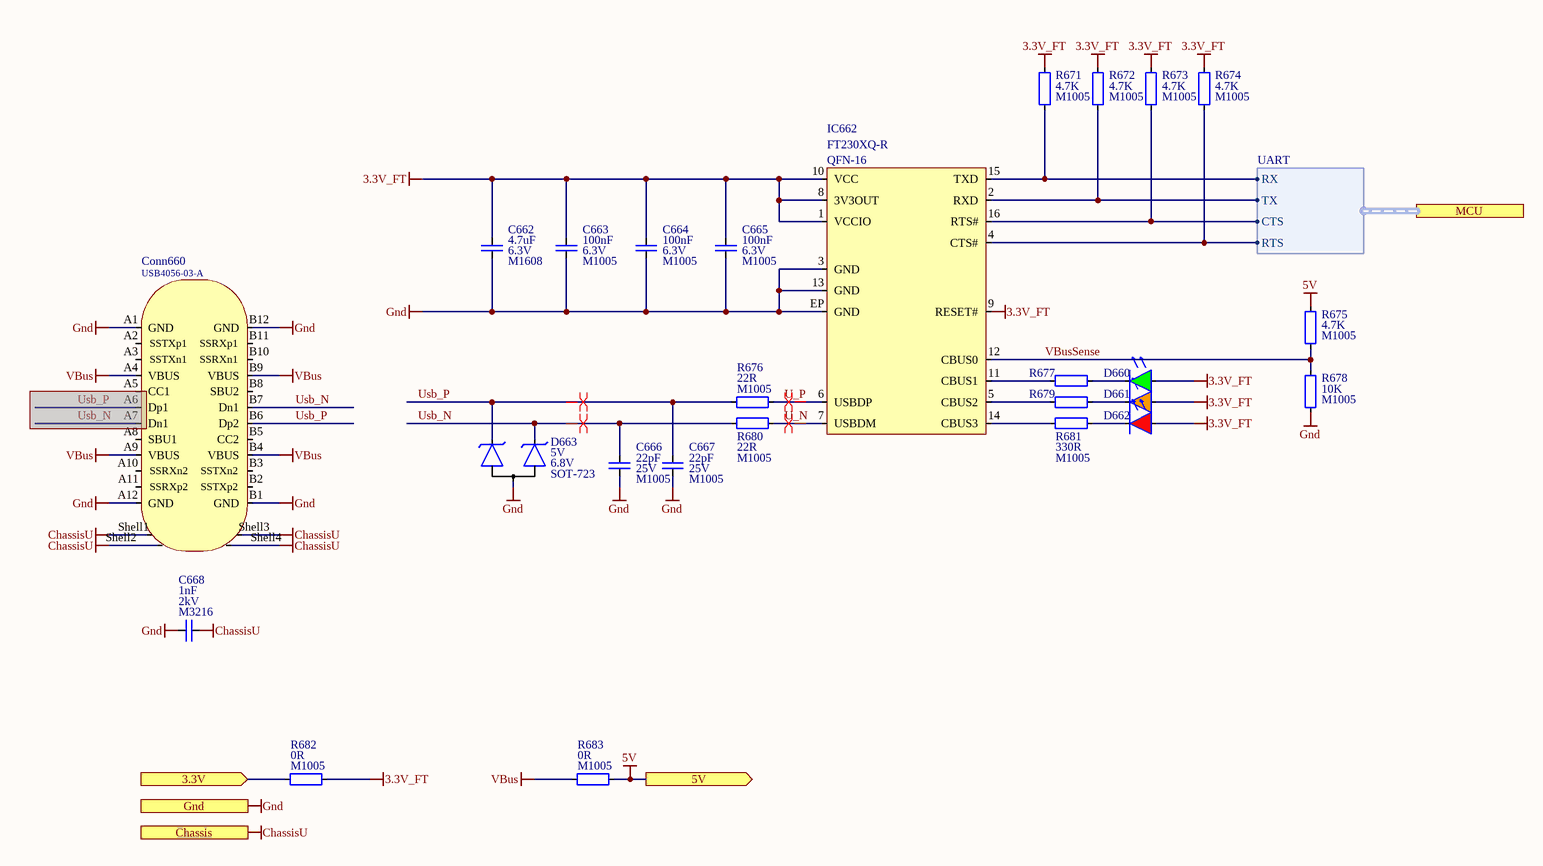
[diagram p3: FTDI.SchDoc]

### Parts
C662  value 4.7uF  Voltage: 6.3V  Package: M1608  [Capacitor_Ceramic_M1608_I0603]  (hidden comment: Capacitor_Ceramic)
C663  value 100nF  Voltage: 6.3V  Package: M1005  [Capacitor_Ceramic_M1005_I0402]  (hidden comment: Capacitor_Ceramic)
C664  value 100nF  Voltage: 6.3V  Package: M1005  [Capacitor_Ceramic_M1005_I0402]  (hidden comment: Capacitor_Ceramic)
C665  value 100nF  Voltage: 6.3V  Package: M1005  [Capacitor_Ceramic_M1005_I0402]  (hidden comment: Capacitor_Ceramic)
C666  value 22pF  Voltage: 25V  Package: M1005  [Capacitor_Ceramic_M1005_I0402]  (hidden comment: Capacitor_Ceramic)
C667  value 22pF  Voltage: 25V  Package: M1005  [Capacitor_Ceramic_M1005_I0402]  (hidden comment: Capacitor_Ceramic)
C668  value 1nF  Voltage: 2kV  Package: M3216  [Capacitor_Ceramic_M3216_I1206]  (hidden comment: Capacitor_Ceramic)
Conn660  Manufacturer Part Number: USB4056-03-A  [GCT, USB4056]  (hidden comment: GCT, USB4056)
D660  Diode_Led  [Diode_Smd_M1608_I0603_Green-Yellow]  (value not drawn)
D661  Diode_Led  [Diode_Smd_M1608_I0603_Orange1]  (value not drawn)
D662  Diode_Led  [Diode_Smd_M1608_I0603_Red]  (value not drawn)
D663  Voltage, Break Down: 6.8V  Voltage, Stand Off: 5V  Package: SOT-723  [Diode_SOT-723_2P_Common_Anode_Type_1]  (hidden comment: Diode_Tvs_2P_Common_Anode)
IC662  Manufacturer Part Number: FT230XQ-R  Package: QFN-16  [QFN-16, 4mm x 4mm, 0.65mm]  (hidden comment: FTDI, FT230XQ)
R671  value 4.7K  Package: M1005  [Resistor_Smd_M1005_I0402]  (hidden comment: Resistor)
R672  value 4.7K  Package: M1005  [Resistor_Smd_M1005_I0402]  (hidden comment: Resistor)
R673  value 4.7K  Package: M1005  [Resistor_Smd_M1005_I0402]  (hidden comment: Resistor)
R674  value 4.7K  Package: M1005  [Resistor_Smd_M1005_I0402]  (hidden comment: Resistor)
R675  value 4.7K  Package: M1005  [Resistor_Smd_M1005_I0402]  (hidden comment: Resistor)
R676  value 22R  Package: M1005  [Resistor_Smd_M1005_I0402]  (hidden comment: Resistor)
R677  Resistor  [Resistor_Smd_M1005_I0402]  (value not drawn)
R678  value 10K  Package: M1005  [Resistor_Smd_M1005_I0402]  (hidden comment: Resistor)
R679  Resistor  [Resistor_Smd_M1005_I0402]  (value not drawn)
R680  value 22R  Package: M1005  [Resistor_Smd_M1005_I0402]  (hidden comment: Resistor)
R681  value 330R  Package: M1005  [Resistor_Smd_M1005_I0402]  (hidden comment: Resistor)
R682  value 0R  Package: M1005  [Resistor_Smd_M1005_I0402]  (hidden comment: Resistor)
R683  value 0R  Package: M1005  [Resistor_Smd_M1005_I0402]  (hidden comment: Resistor)

### Ports
3.3V (in), 5V (out), Chassis (in), Gnd (in), MCU (harness UART)

### Harnesses
UART: RX, TX, RTS, CTS

### Nets
3.3V: R682.1 ; port 3.3V
3.3V_FT: C662.1 C663.1 C664.1 C665.1 D660.A D661.A D662.A IC662.1(VCCIO) IC662.8(3V3OUT) IC662.9(RESET#) IC662.10(VCC) R671.1 R672.1 R673.1 R674.1 R682.2
5V: R675.1 R683.2 ; port 5V
ChassisU: C668.2 Conn660.Shell1(Chassis1) Conn660.Shell2(Chassis2) Conn660.Shell3(Chassis3) Conn660.Shell4(Chassis4) ; port Chassis
Gnd: C662.2 C663.2 C664.2 C665.2 C666.2 C667.2 C668.1 Conn660.A1(GND) Conn660.A12(GND) Conn660.B1(GND) Conn660.B12(GND) D663.A IC662.3(GND) IC662.13(GND) IC662.EP(GND) R678.2 ; port Gnd
VBus: Conn660.A4(VBUS) Conn660.A9(VBUS) Conn660.B4(VBUS) Conn660.B9(VBUS) R683.1
PB10: IC662.2(RXD) R672.2 ; port MCU.TX
PB14: IC662.4(CTS#) R674.2 ; port MCU.RTS
PD9: IC662.15(TXD) R671.2 ; port MCU.RX
PD11: IC662.16(RTS#) R673.2 ; port MCU.CTS
U_N: IC662.7(USBDM) R680.2
U_P: IC662.6(USBDP) R676.2
Usb_N: C666.1 Conn660.B7(Dn1) D663.C2 R680.1
Usb_P: C667.1 Conn660.B6(Dp2) D663.C1 R676.1
VBusSense: IC662.12(CBUS0) R675.2 R678.1
NetD660_C: D660.C R677.2
NetD661_C: D661.C R679.2
NetD662_C: D662.C R681.2
NetIC662_5: IC662.5(CBUS2) R679.1
NetIC662_11: IC662.11(CBUS1) R677.1
NetIC662_14: IC662.14(CBUS3) R681.1

Not connected (* = marked no-connect by the designer): Conn660 A2(SSTXp1) A3(SSTXn1) A5(CC1) A6(Dp1) A7(Dn1) A8(SBU1) A10(SSRXn2) A11(SSRXp2) B2(SSTXp2) B3(SSTXn2) B5(CC2) B8(SBU2) B10(SSRXn1) B11(SSRXp1)

### Layout directives
differential pair; differential pair class Usb_90: U_N, U_P, Usb_N, Usb_P

### Library data of the parts
C662 = Capacitor_Ceramic: as C703 on sheet Microcontroller; ComponentLink1Description: Datasheet; ComponentLink1URL: E:\Altium\Datasheets\Capacitor\Samsung - Multi Layer Ceramic Capacitors.pdf; ComponentLink2Description: Supplier Link; ComponentLink2URL: https://www.digikey.com/en/products/detail/samsung-electro-mechanics/CL10A475KQ8NNNC/3886703; Supplier: Digikey; Supplier Part Number: 1276-1045-1-ND; Operating Temperature, Min: +85℃; Operating Temperature, Max: -55℃; Quantity, Min: 1; Quantity, Max: 400000; Price, Min: 0.1; Supplier Currency: $; Price, Max: 0.00444; Supplier Link: https://www.digikey.com/en/products/detail/samsung-electro-mechanics/CL10A475KQ8NNNC/3886703; Component Type: Ceramic; Component Category: Capacitor
C663-C665 = Capacitor_Ceramic: as C700 on sheet Microcontroller; ComponentLink1Description: Datasheet; ComponentLink1URL: E:\Altium\Datasheets\Capacitor\Kyocera - X5R.pdf; ComponentLink2Description: Supplier Link; ComponentLink2URL: https://www.digikey.com/en/products/detail/kyocera-avx/04026D104KAT4A/8107673; Supplier: Digikey; Supplier Part Number: 478-11504-1-ND; Operating Temperature, Min: +85℃; Operating Temperature, Max: -55℃; Quantity, Min: 1; Quantity, Max: 250000; Price, Min: 0.1; Supplier Currency: $; Price, Max: 0.00189; Supplier Link: https://www.digikey.com/en/products/detail/kyocera-avx/04026D104KAT4A/8107673; Component Type: Ceramic; Component Category: Capacitor
C666 C667 = Capacitor_Ceramic: as C701 on sheet Microcontroller; ComponentLink1Description: Datasheet; ComponentLink1URL: E:\Altium\Datasheets\Capacitor\Walsin - Multilayer Ceramic Capacitors.pdf; ComponentLink2Description: Supplier Link; ComponentLink2URL: https://www.digikey.com/en/products/detail/walsin-technology-corporation/0402N220J250CT/9354779; Supplier: Digikey; Supplier Part Number: 1292-1282-1-ND; Operating Temperature, Min: +125℃; Operating Temperature, Max: -55℃; Quantity, Min: 1; Quantity, Max: 250000; Price, Min: 0.1; Supplier Currency: $; Price, Max: 0.00177; Supplier Link: https://www.digikey.com/en/products/detail/walsin-technology-corporation/0402N220J250CT/9354779; Component Type: Ceramic; Component Category: Capacitor
C668 = Capacitor_Ceramic: Cap, Cer, 1nF, 2kV, M3216; Manufacturer Part Number: CC1206MKX7RDBB102; Manufacturer: Yageo; Temperature Coefficient: X7R; Tolerance: 20%; ComponentLink1Description: Datasheet; ComponentLink1URL: E:\Altium\Datasheets\Capacitor\Yageo - Surface-Mount Ceramic Multilayer Capacitors.pdf; ComponentLink2Description: Supplier Link; ComponentLink2URL: https://www.digikey.com/en/products/detail/yageo/CC1206MKX7RDBB102/5884663; Supplier: Digikey; Supplier Part Number: 311-4501-1-ND; Operating Temperature, Min: +125℃; Operating Temperature, Max: -55℃; Quantity, Min: 1; Quantity, Max: 300000; Price, Min: 0.23; Supplier Currency: $; Price, Max: 0.03271; Supplier Link: https://www.digikey.com/en/products/detail/yageo/CC1206MKX7RDBB102/5884663; Component Type: Ceramic; Component Category: Capacitor
Conn660 = GCT, USB4056: Conn, USB, TYPE-C; Component Category: Connector; ComponentLink1Description: Datasheet; ComponentLink1URL: E:\Altium\Datasheets\Connector - USB\GCT, USB4056.pdf; ComponentLink2Description: Supplier Link; ComponentLink2URL: https://www.digikey.com/en/products/detail/gct/USB4056-03-A/14638038; Supplier: Digikey; Supplier Part Number: 2073-USB4056-03-ACT-ND; Manufacturer: GCT; Operating Temperature, Min: -25℃; Operating Temperature, Max: +85℃; Quantity, Min: 1; Quantity, Max: 10000; Price, Min: 0.97; Supplier Currency: $; Price, Max: 0.44463; Supplier Link: https://www.digikey.com/en/products/detail/gct/USB4056-03-A/14638038; Component Type: USB; Package: TH+SMT, Side
D660 = Diode_Led: Diode, Led, Green-Yellow, 2.2V, 20mA, M1608; Manufacturer Part Number: SML-D12M1WT86; Manufacturer: Rohm; ComponentLink1Description: Datasheet; ComponentLink1URL: E:\Altium\Datasheets\Diode\Rohm, SML-D12x1 Series.pdf; ComponentLink2Description: Supplier Link; ComponentLink2URL: https://www.digikey.com/en/products/detail/rohm-semiconductor/SML-D12M1WT86/5843856; Supplier: Digikey; Supplier Part Number: SML-D12M1WT86CT-ND; Operating Temperature, Min: -40℃; Operating Temperature, Max: +85℃; Quantity, Min: 1; Quantity, Max: 75000; Price, Min: 0.25; Price, Max: 0.02838; Supplier Currency: $; Supplier Link: https://www.digikey.com/en/products/detail/rohm-semiconductor/SML-D12M1WT86/5843856; Component Type: Led; Component Category: Diode; Current: 20mA; Voltage: 2.2V; Package: M1608
D661 = Diode_Led: Diode, Led, Orange, 2.2V, 20mA, M1608; Manufacturer Part Number: SML-D12D1WT86; Manufacturer: Rohm; ComponentLink1Description: Datasheet; ComponentLink1URL: E:\Altium\Datasheets\Diode\Rohm, SML-D12x1 Series.pdf; ComponentLink2Description: Supplier Link; ComponentLink2URL: https://www.digikey.com/en/products/detail/rohm-semiconductor/SML-D12D1WT86/5843854; Supplier: Digikey; Supplier Part Number: SML-D12D1WT86CT-ND; Operating Temperature, Min: -40℃; Operating Temperature, Max: +85℃; Quantity, Min: 1; Quantity, Max: 75000; Price, Min: 0.25; Price, Max: 0.02838; Supplier Currency: $; Supplier Link: https://www.digikey.com/en/products/detail/rohm-semiconductor/SML-D12D1WT86/5843854; Component Type: Led; Component Category: Diode; Current: 20mA; Voltage: 2.2V; Package: M1608
D662 = Diode_Led: Diode, Led, Red, 2.2V, 20mA, M1608; Manufacturer Part Number: SML-D12U1WT86; Manufacturer: Rohm; ComponentLink1Description: Datasheet; ComponentLink1URL: E:\Altium\Datasheets\Diode\Rohm, SML-D12x1 Series.pdf; ComponentLink2Description: Supplier Link; ComponentLink2URL: https://www.digikey.com/en/products/detail/rohm-semiconductor/SML-D12U1WT86/5843853; Supplier: Digikey; Supplier Part Number: SML-D12U1WT86CT-ND; Operating Temperature, Min: -40℃; Operating Temperature, Max: +85℃; Quantity, Min: 1; Quantity, Max: 75000; Price, Min: 0.25; Price, Max: 0.02838; Supplier Currency: $; Supplier Link: https://www.digikey.com/en/products/detail/rohm-semiconductor/SML-D12U1WT86/5843853; Component Type: Led; Component Category: Diode; Current: 20mA; Voltage: 2.2V; Package: M1608
D663 = Diode_Tvs_2P_Common_Anode: Diode, TVS, 5V/6.8V, SOD-723; Manufacturer Part Number: DF3A6.8LFV,L3F; Manufacturer: Toshiba; ComponentLink1Description: Datasheet; ComponentLink1URL: E:\Altium\Datasheets\Diode\Toshiba, DF3A6.8LFV.pdf; ComponentLink2Description: Supplier Link; ComponentLink2URL: https://www.digikey.com/en/products/detail/toshiba-semiconductor-and-storage/DF3A6-8LFV-L3F/4305070; Supplier: Digikey; Supplier Part Number: DF3A6.8LFVL3FCT-ND; Operating Temperature, Min: ---℃; Operating Temperature, Max: ---℃; Quantity, Min: 1; Quantity, Max: 200000; Price, Min: 0.25; Price, Max: 0.027; Supplier Currency: $; Supplier Link: https://www.digikey.com/en/products/detail/toshiba-semiconductor-and-storage/DF3A6-8LFV-L3F/4305070; Component Type: Tvs; Component Category: Diode
IC662 = FTDI, FT230XQ: IC, Interface, FTDI, QFN-16; ComponentLink1Description: Datasheet; ComponentLink1URL: E:\Altium\Datasheets\IC - Interface\FTDI, FT230X.pdf; ComponentLink2Description: Supplier Link; ComponentLink2URL: https://www.digikey.com/en/products/detail/ftdi-future-technology-devices-international-ltd/FT230XQ-R/3029142; Supplier: Digikey; Supplier Part Number: 768-1130-1-ND; Manufacturer: FTDI; Operating Temperature, Min: -40℃; Operating Temperature, Max: +85℃; Quantity, Min: 1; Quantity, Max: 5000; Price, Min: 2.14; Supplier Currency: $; Price, Max: 1.7125; Supplier Link: https://www.digikey.com/en/products/detail/ftdi-future-technology-devices-international-ltd/FT230XQ-R/3029142; Component Type: Interface; Component Category: IC
R671-R675 = Resistor: Res, 4.7K, 1%, M1005; Manufacturer: Yageo; Manufacturer Part Number: RC0402FR-074K7L; Component Category: Resistor; Component Type: Fixed Value; Tolerance: 1%; Supplier Link: https://www.digikey.com/en/products/detail/yageo/RC0402FR-074K7L/2827563; Supplier Currency: $; Price, Max: 0.00129; Price, Min: 0.1; Quantity, Max: 100000; Quantity, Min: 1; Operating Temperature, Max: -55℃; Operating Temperature, Min: +155℃; Supplier Part Number: 311-4.7KLRCT-ND; Supplier: Digikey; ComponentLink1Description: Datasheet; ComponentLink1URL: E:\Altium\Datasheets\Resistor\Yageo - RC_L Series.pdf; ComponentLink2Description: Supplier Link; ComponentLink2URL: https://www.digikey.com/en/products/detail/yageo/RC0402FR-074K7L/2827563
R676 R680 = Resistor: as R700 on sheet Microcontroller; Component Category: Resistor; Component Type: Fixed Value; Tolerance: 1%; Supplier Link: https://www.digikey.com/en/products/detail/yageo/RC0402FR-0722RL/726562; Supplier Currency: $; Price, Max: 0.00129; Price, Min: 0.1; Quantity, Max: 100000; Quantity, Min: 1; Operating Temperature, Max: -55℃; Operating Temperature, Min: +155℃; Supplier Part Number: 311-22.0LRCT-ND; Supplier: Digikey; ComponentLink1Description: Datasheet; ComponentLink1URL: E:\Altium\Datasheets\Resistor\Yageo - RC_L Series.pdf; ComponentLink2Description: Supplier Link; ComponentLink2URL: https://www.digikey.com/en/products/detail/yageo/RC0402FR-0722RL/726562
R677 R679 R681 = Resistor: as R660 on sheet LCD; Component Category: Resistor; Component Type: Fixed Value; Tolerance: 1%; Supplier Link: https://www.digikey.com/en/products/detail/yageo/RC0402FR-07330RL/726594; Supplier Currency: $; Price, Max: 0.00129; Price, Min: 0.1; Quantity, Max: 100000; Quantity, Min: 1; Operating Temperature, Max: -55℃; Operating Temperature, Min: +155℃; Supplier Part Number: 311-330LRCT-ND; Supplier: Digikey; ComponentLink1Description: Datasheet; ComponentLink1URL: E:\Altium\Datasheets\Resistor\Yageo - RC_L Series.pdf; ComponentLink2Description: Supplier Link; ComponentLink2URL: https://www.digikey.com/en/products/detail/yageo/RC0402FR-07330RL/726594
  R677 R679: Value: 330R; Package: M1005
R678 = Resistor: as R706 on sheet Microcontroller; Component Category: Resistor; Component Type: Fixed Value; Tolerance: 1%; Supplier Link: https://www.digikey.com/en/products/detail/yageo/RC0402FR-0710KP/4935264; Supplier Currency: $; Price, Max: 0.00282; Price, Min: 0.1; Quantity, Max: 100000; Quantity, Min: 1; Operating Temperature, Max: -55℃; Operating Temperature, Min: +155℃; Supplier Part Number: YAG1249CT-ND; Supplier: Digikey; ComponentLink1Description: Datasheet; ComponentLink1URL: E:\Altium\Datasheets\Resistor\Yageo - RC_L Series.pdf; ComponentLink2Description: Supplier Link; ComponentLink2URL: https://www.digikey.com/en/products/detail/yageo/RC0402FR-0710KP/4935264
R682 R683 = Resistor: as R708 on sheet Microcontroller; Component Category: Resistor; Component Type: Fixed Value; Tolerance: *; Supplier Link: https://www.digikey.com/en/products/detail/yageo/RC0402FR-070RL/2827570; Supplier Currency: $; Price, Max: 0.00109; Price, Min: 0.1; Quantity, Max: 50000; Quantity, Min: 1; Operating Temperature, Max: -55℃; Operating Temperature, Min: +155℃; Supplier Part Number: 311-0.0LRCT-ND; Supplier: Digikey; ComponentLink1Description: Datasheet; ComponentLink1URL: E:\Altium\Datasheets\Resistor\Yageo - RC_L Series.pdf; ComponentLink2Description: Supplier Link; ComponentLink2URL: https://www.digikey.com/en/products/detail/yageo/RC0402FR-070RL/2827570